# EAGLE design SchemaPCB1 (EAGLE 9.6.2)

## Sheet 1 of 5: ESP32
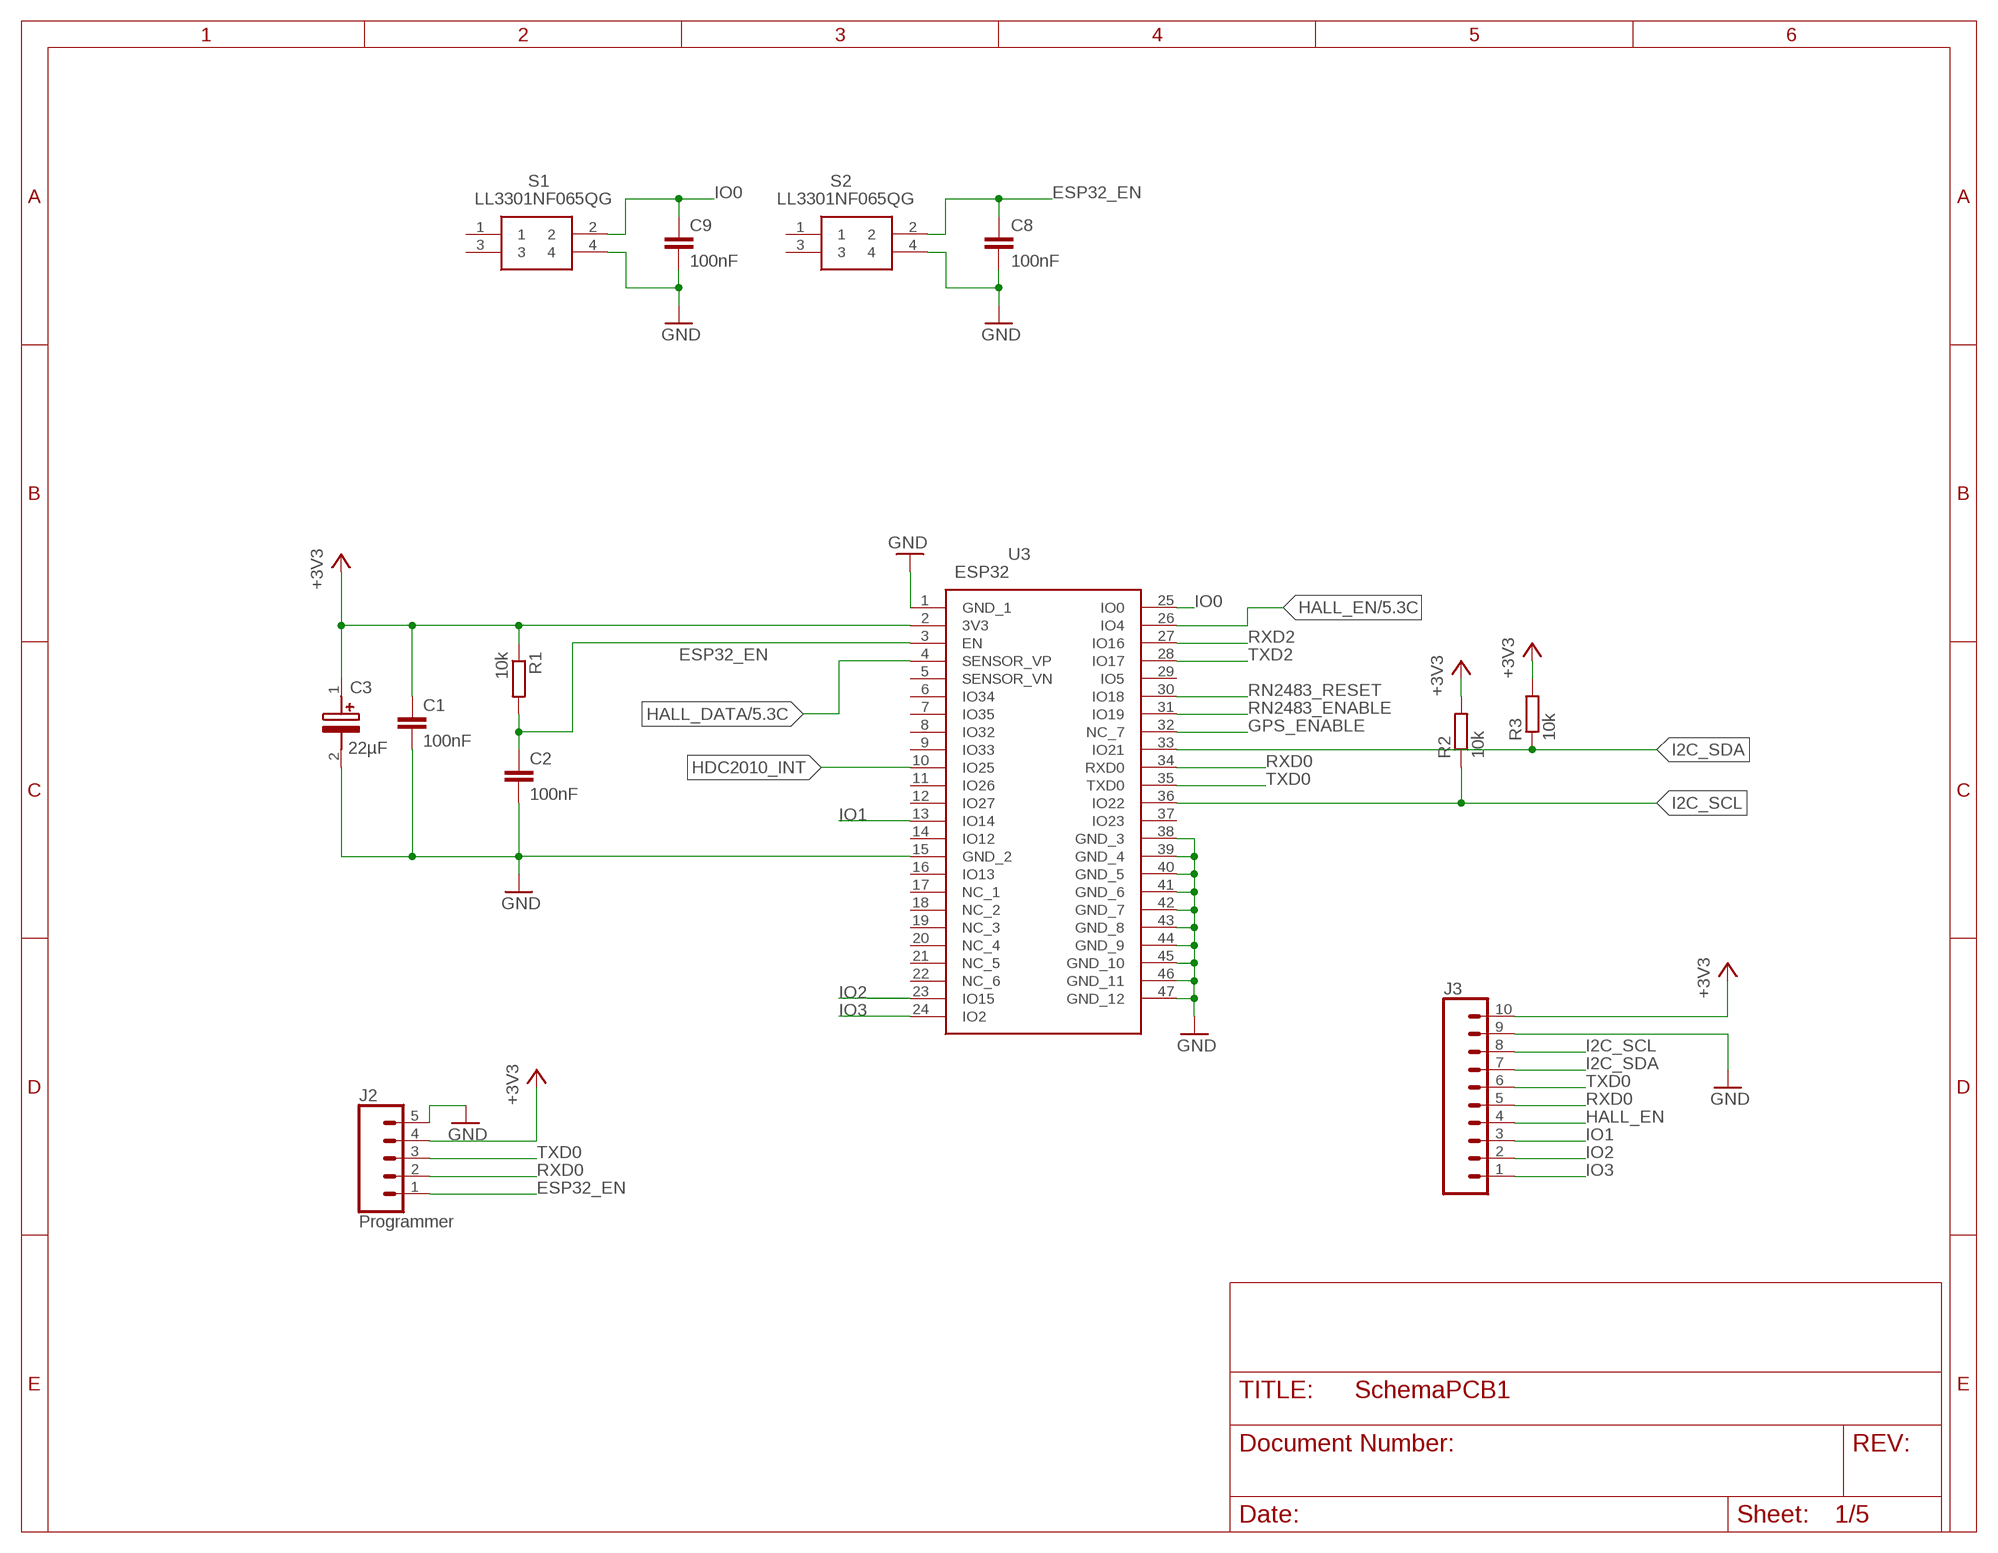
[diagram p0: schematic, sheet 1]

### Parts
C1  100nF  C-EU-0805C0805  [C0805]
C2  100nF  C-EU-0805C0805  [C0805]
C3  22µF  VE-220M1VTR-0605  [CAPAE660X550N]
C8  100nF  C-EU-0805C0805  [C0805]
C9  100nF  C-EU-0805C0805  [C0805]
J2  Programmer  CONN_05  [1X05]
J3  CONN_10"  [1X10]
R1  10k  R-EU_0805M0805  [M0805]
R2  10k  R-EU_R0805  [R0805]
R3  10k  R-EU_R0805  [R0805]
S1  LL3301NF065QG  [LL3301NF065QG]
S2  LL3301NF065QG  [LL3301NF065QG]
U3  ESP32  ESP32-WROOM-32E_M113EH3200PH3Q  [ESP32WROOM32EM113EH3200PH3Q0]

### Nets
+3V3: C1.1 C3.1(+) J2.4 J3.10 R1.1 R2.2 R3.2 U3.2(3V3) ; also sheet 2,3,4,5
ESP32_EN: C2.1 C8.2 J2.1 R1.2 S2.2 U3.3(EN)
GND: C1.2 C2.2 C3.2(-) C8.1 C9.2 J2.5 J3.9 S1.4 S2.4 U3.1(GND_1) U3.15(GND_2) U3.38(GND_3) U3.39(GND_4) U3.40(GND_5) U3.41(GND_6) U3.42(GND_7) U3.43(GND_8) U3.44(GND_9) U3.45(GND_10) U3.46(GND_11) U3.47(GND_12) ; also sheet 2,3,4,5
GPS_ENABLE: U3.32(NC_7) ; also sheet 3
HALL_DATA: U3.4(SENSOR_VP) ; also sheet 5
HALL_EN: J3.4 U3.26(IO4) ; also sheet 5
HDC2010_INT: U3.10(IO25) ; also sheet 5
I2C_SCL: J3.8 R2.1 U3.36(IO22) ; also sheet 3,5
I2C_SDA: J3.7 R3.1 U3.33(IO21) ; also sheet 3,5
IO0: C9.1 S1.2 U3.25(IO0)
IO1: J3.3 U3.13(IO14)
IO2: J3.2 U3.23(IO15)
IO3: J3.1 U3.24(IO2)
RN2483_ENABLE: U3.31(IO19) ; also sheet 2
RN2483_RESET: U3.30(IO18) ; also sheet 2
RXD0: J2.2 J3.5 U3.34(RXD0)
RXD2: U3.27(IO16) ; also sheet 2
TXD0: J2.3 J3.6 U3.35(TXD0)
TXD2: U3.28(IO17) ; also sheet 2
Unconnected: S1.1 S1.3 S2.1 S2.3 U3.5(SENSOR_VN) U3.6(IO34) U3.7(IO35) U3.8(IO32) U3.9(IO33) U3.11(IO26) U3.12(IO27) U3.14(IO12) U3.16(IO13) U3.17(NC_1) U3.18(NC_2) U3.19(NC_3) U3.20(NC_4) U3.21(NC_5) U3.22(NC_6) U3.29(IO5) U3.37(IO23)

## Sheet 2 of 5: LoRa
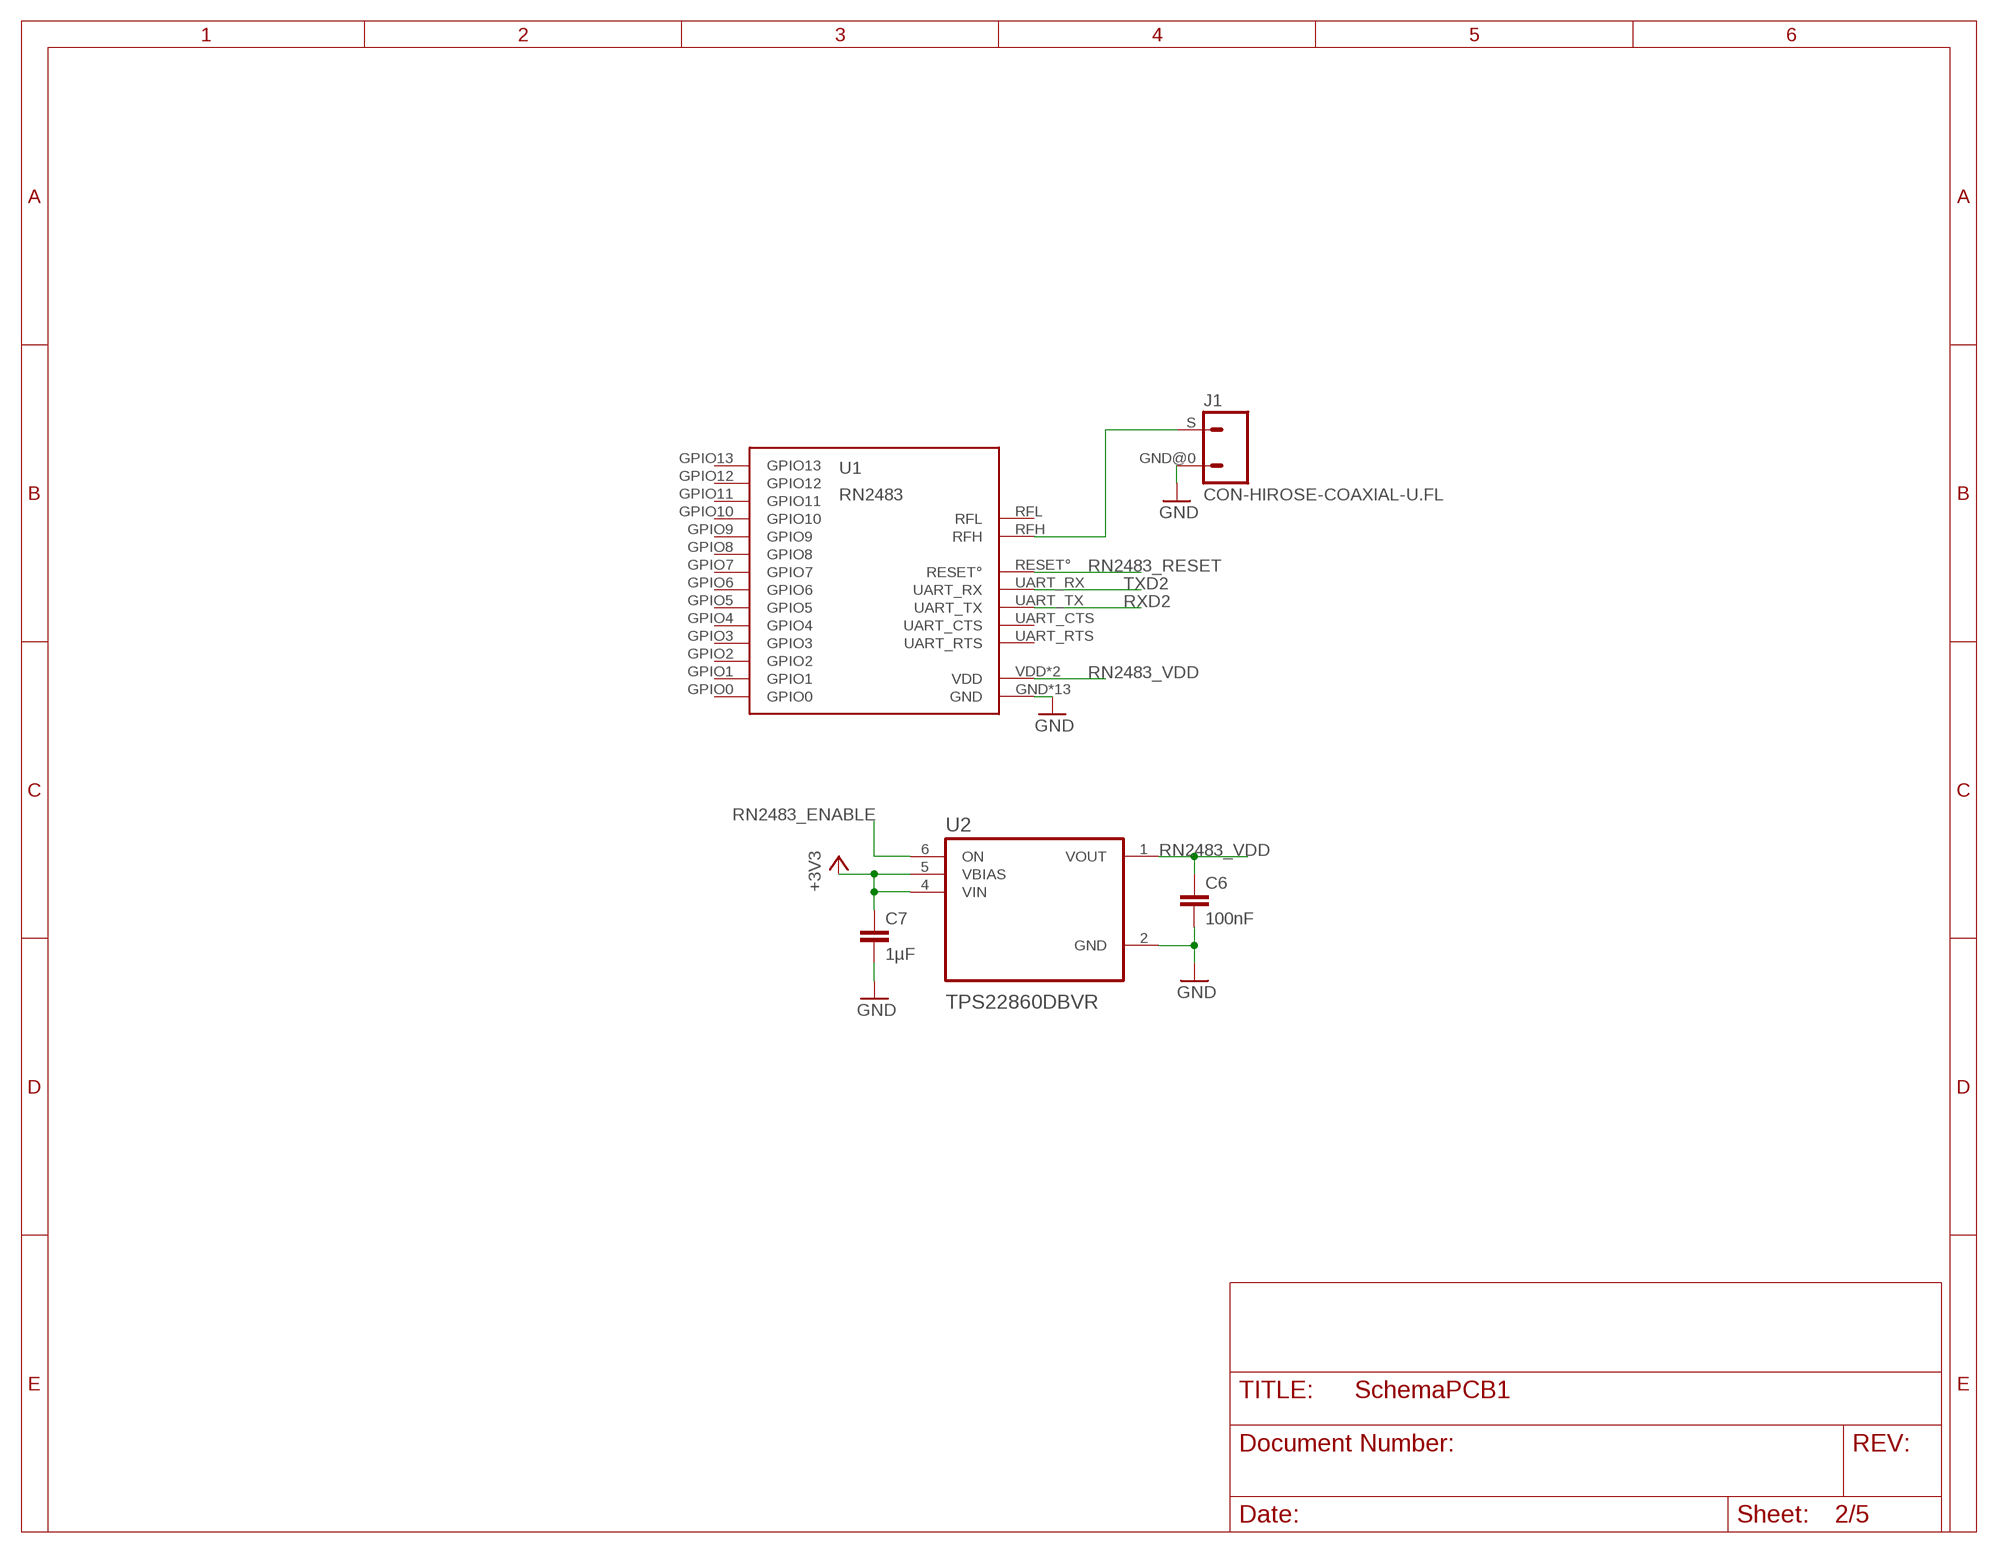
[diagram p1: schematic, sheet 2]

### Parts
C6  100nF  C-EU-0805C0805  [C0805]
C7  1µF  C-EU-0805C0805  [C0805]
J1  CON-HIROSE-COAXIAL-U.FL  [CON-U.FL]
U1  RN2483  [RN2483]
U2  TPS22860DBVR  [SOT95P280X145-6N]

### Nets
+3V3: C7.1 U2.4(VIN) U2.5(VBIAS) ; also sheet 1,3,4,5
GND: C6.2 C7.2 J1.GND@0 U1.GND U1.GND1(GND) U1.GND2(GND) U1.GND3(GND) U1.GND4(GND) U1.GND5(GND) U1.GND6(GND) U1.GND7(GND) U1.GND8(GND) U1.GND9(GND) U1.GND10(GND) U1.GND11(GND) U1.GND12(GND) U2.2(GND) ; also sheet 1,3,4,5
N$4: J1.S U1.RFH
RN2483_ENABLE: U2.6(ON) ; also sheet 1
RN2483_RESET: U1.RESET° ; also sheet 1
RN2483_VDD: C6.1 U1.VDD U1.VDD2(VDD) U2.1(VOUT)
RXD2: U1.UART_TX ; also sheet 1
TXD2: U1.UART_RX ; also sheet 1
Unconnected: U1.GPIO0 U1.GPIO1 U1.GPIO2 U1.GPIO3 U1.GPIO4 U1.GPIO5 U1.GPIO6 U1.GPIO7 U1.GPIO8 U1.GPIO9 U1.GPIO10 U1.GPIO11 U1.GPIO12 U1.GPIO13 U1.RFL U1.UART_CTS U1.UART_RTS

## Sheet 3 of 5: GPS
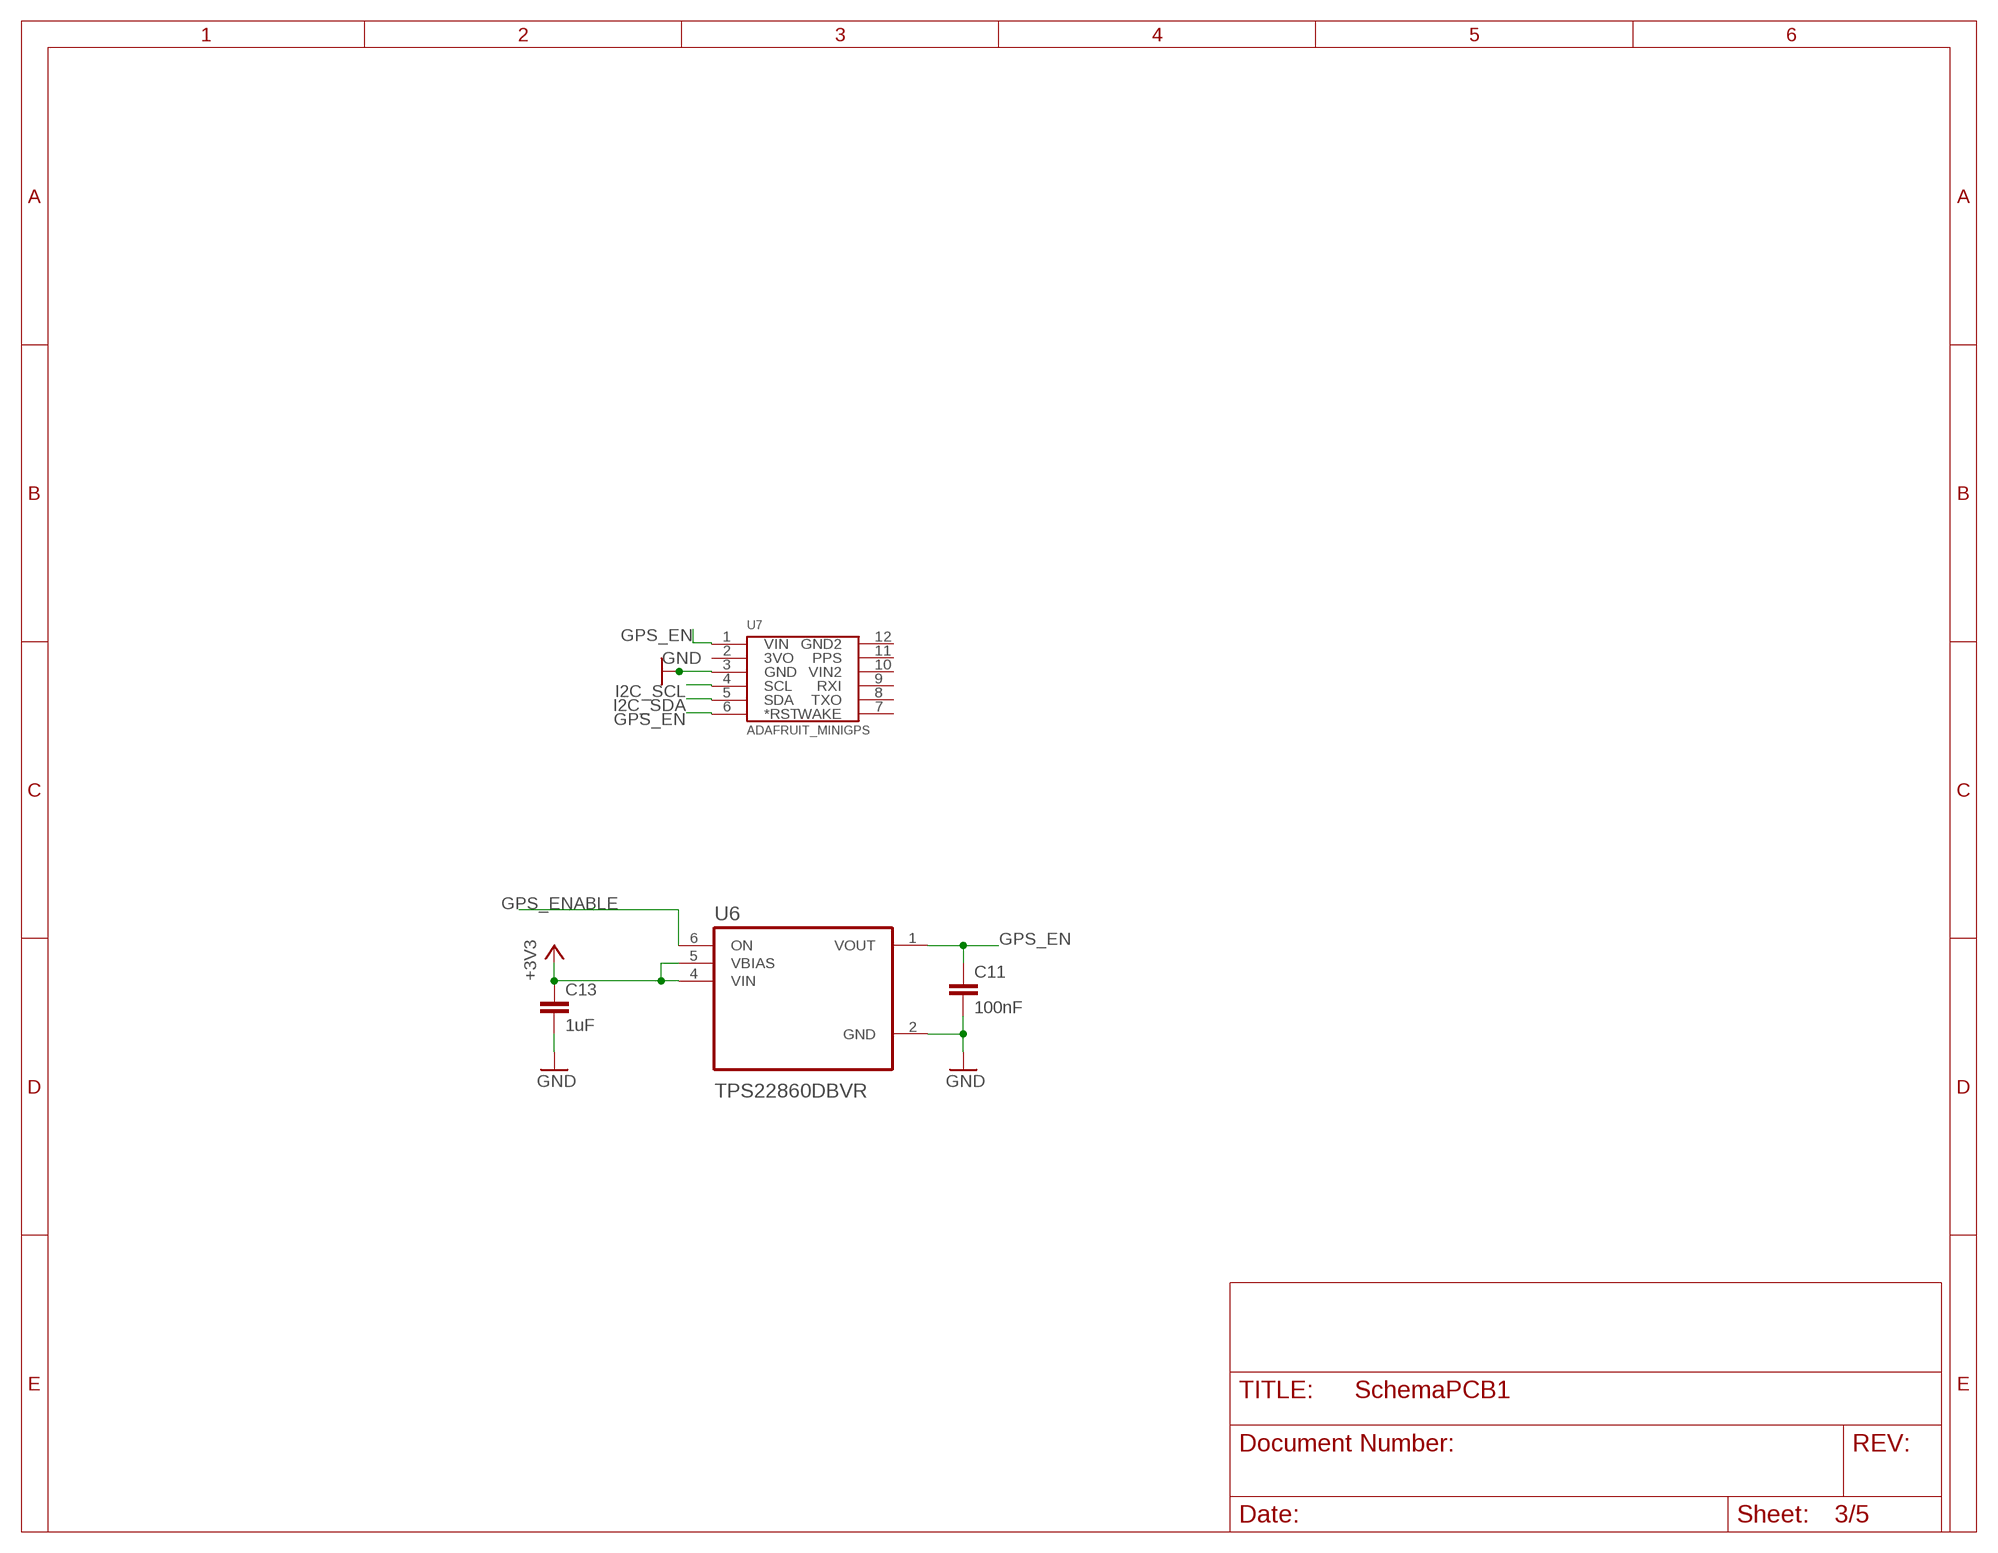
[diagram p2: schematic, sheet 3]

### Parts
C11  100nF  C-EUC0805  [C0805]
C13  1uF  C-EUC0805  [C0805]
U6  TPS22860DBVR  [SOT95P280X145-6N]
U7  ADAFRUIT_MINIGPS  [ADAFRUIT_MINIGPS]

### Nets
+3V3: C13.1 U6.4(VIN) U6.5(VBIAS) ; also sheet 1,2,4,5
GND: C11.2 C13.2 U6.2(GND) U7.3(GND) ; also sheet 1,2,4,5
GPS_EN: C11.1 U6.1(VOUT) U7.1(VIN) U7.6(*RST)
GPS_ENABLE: U6.6(ON) ; also sheet 1
I2C_SCL: U7.4(SCL) ; also sheet 1,5
I2C_SDA: U7.5(SDA) ; also sheet 1,5
Unconnected: U7.2(3VO) U7.7(WAKE) U7.8(TXO) U7.9(RXI) U7.10(VIN2) U7.11(PPS) U7.12(GND2)

## Sheet 4 of 5: Power
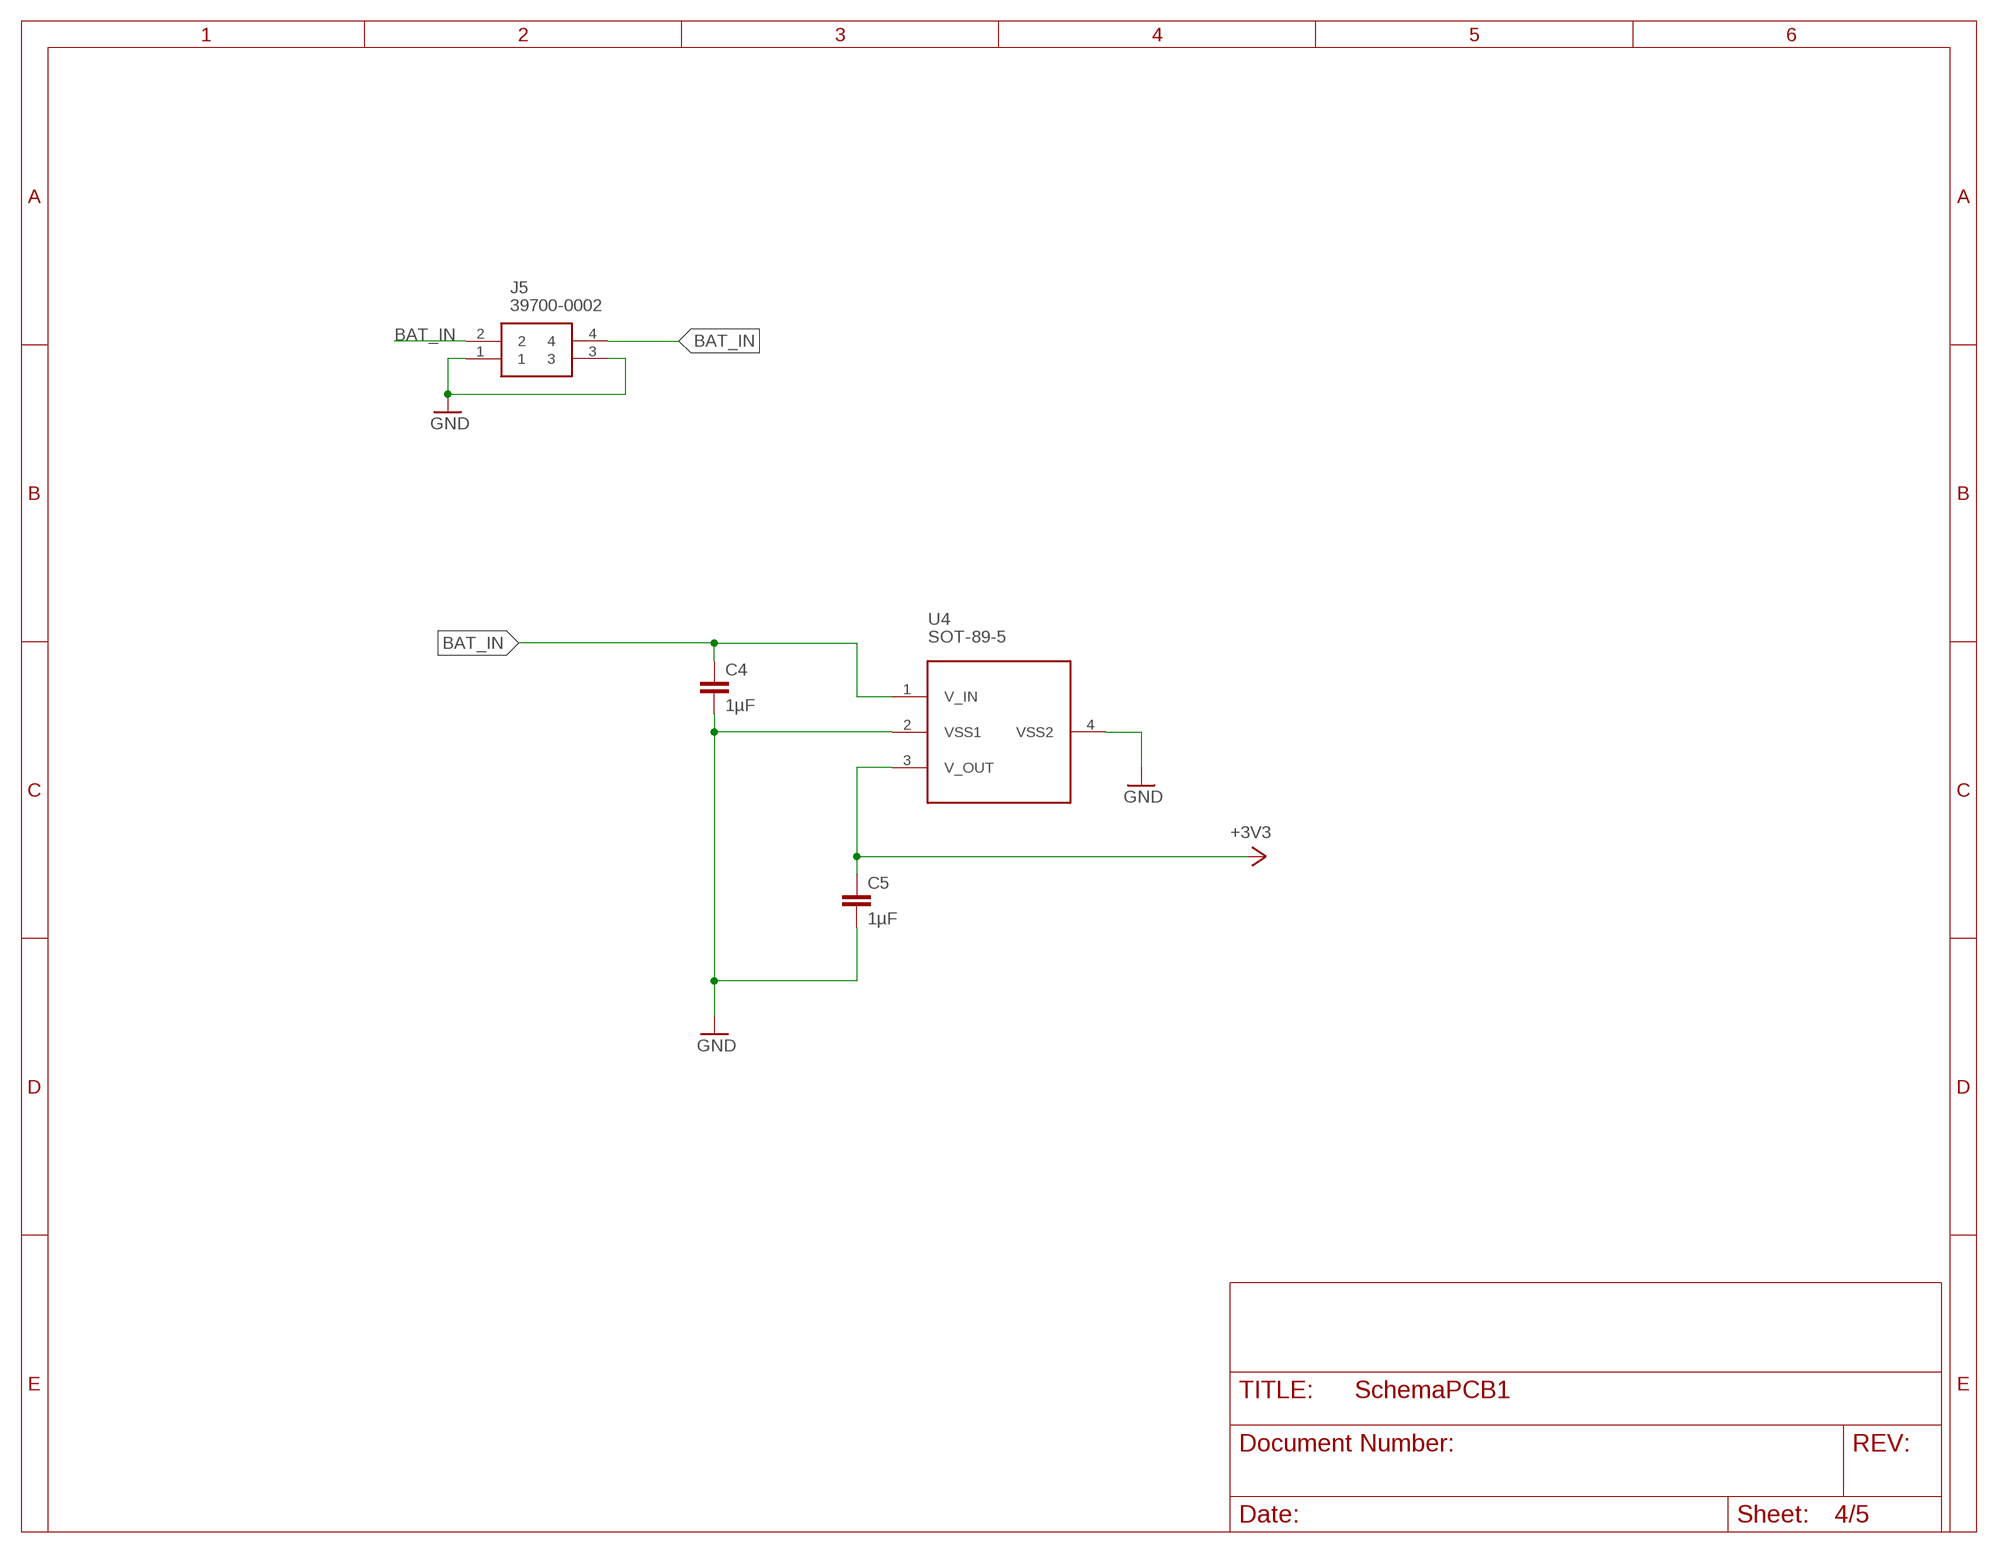
[diagram p3: schematic, sheet 4]

### Parts
C4  1µF  C-EU-0805C0805  [C0805]
C5  1µF  C-EU-0805C0805  [C0805]
J5  39700-0002  [397000002]
U4  SOT-89-5  [SOT-89]

### Nets
+3V3: C5.1 U4.3(V_OUT) ; also sheet 1,2,3,5
BAT_IN: C4.1 J5.2 J5.4 U4.1(V_IN)
GND: C4.2 C5.2 J5.1 J5.3 U4.2(VSS1) U4.4(VSS2) ; also sheet 1,2,3,5

## Sheet 5 of 5: Sensoren
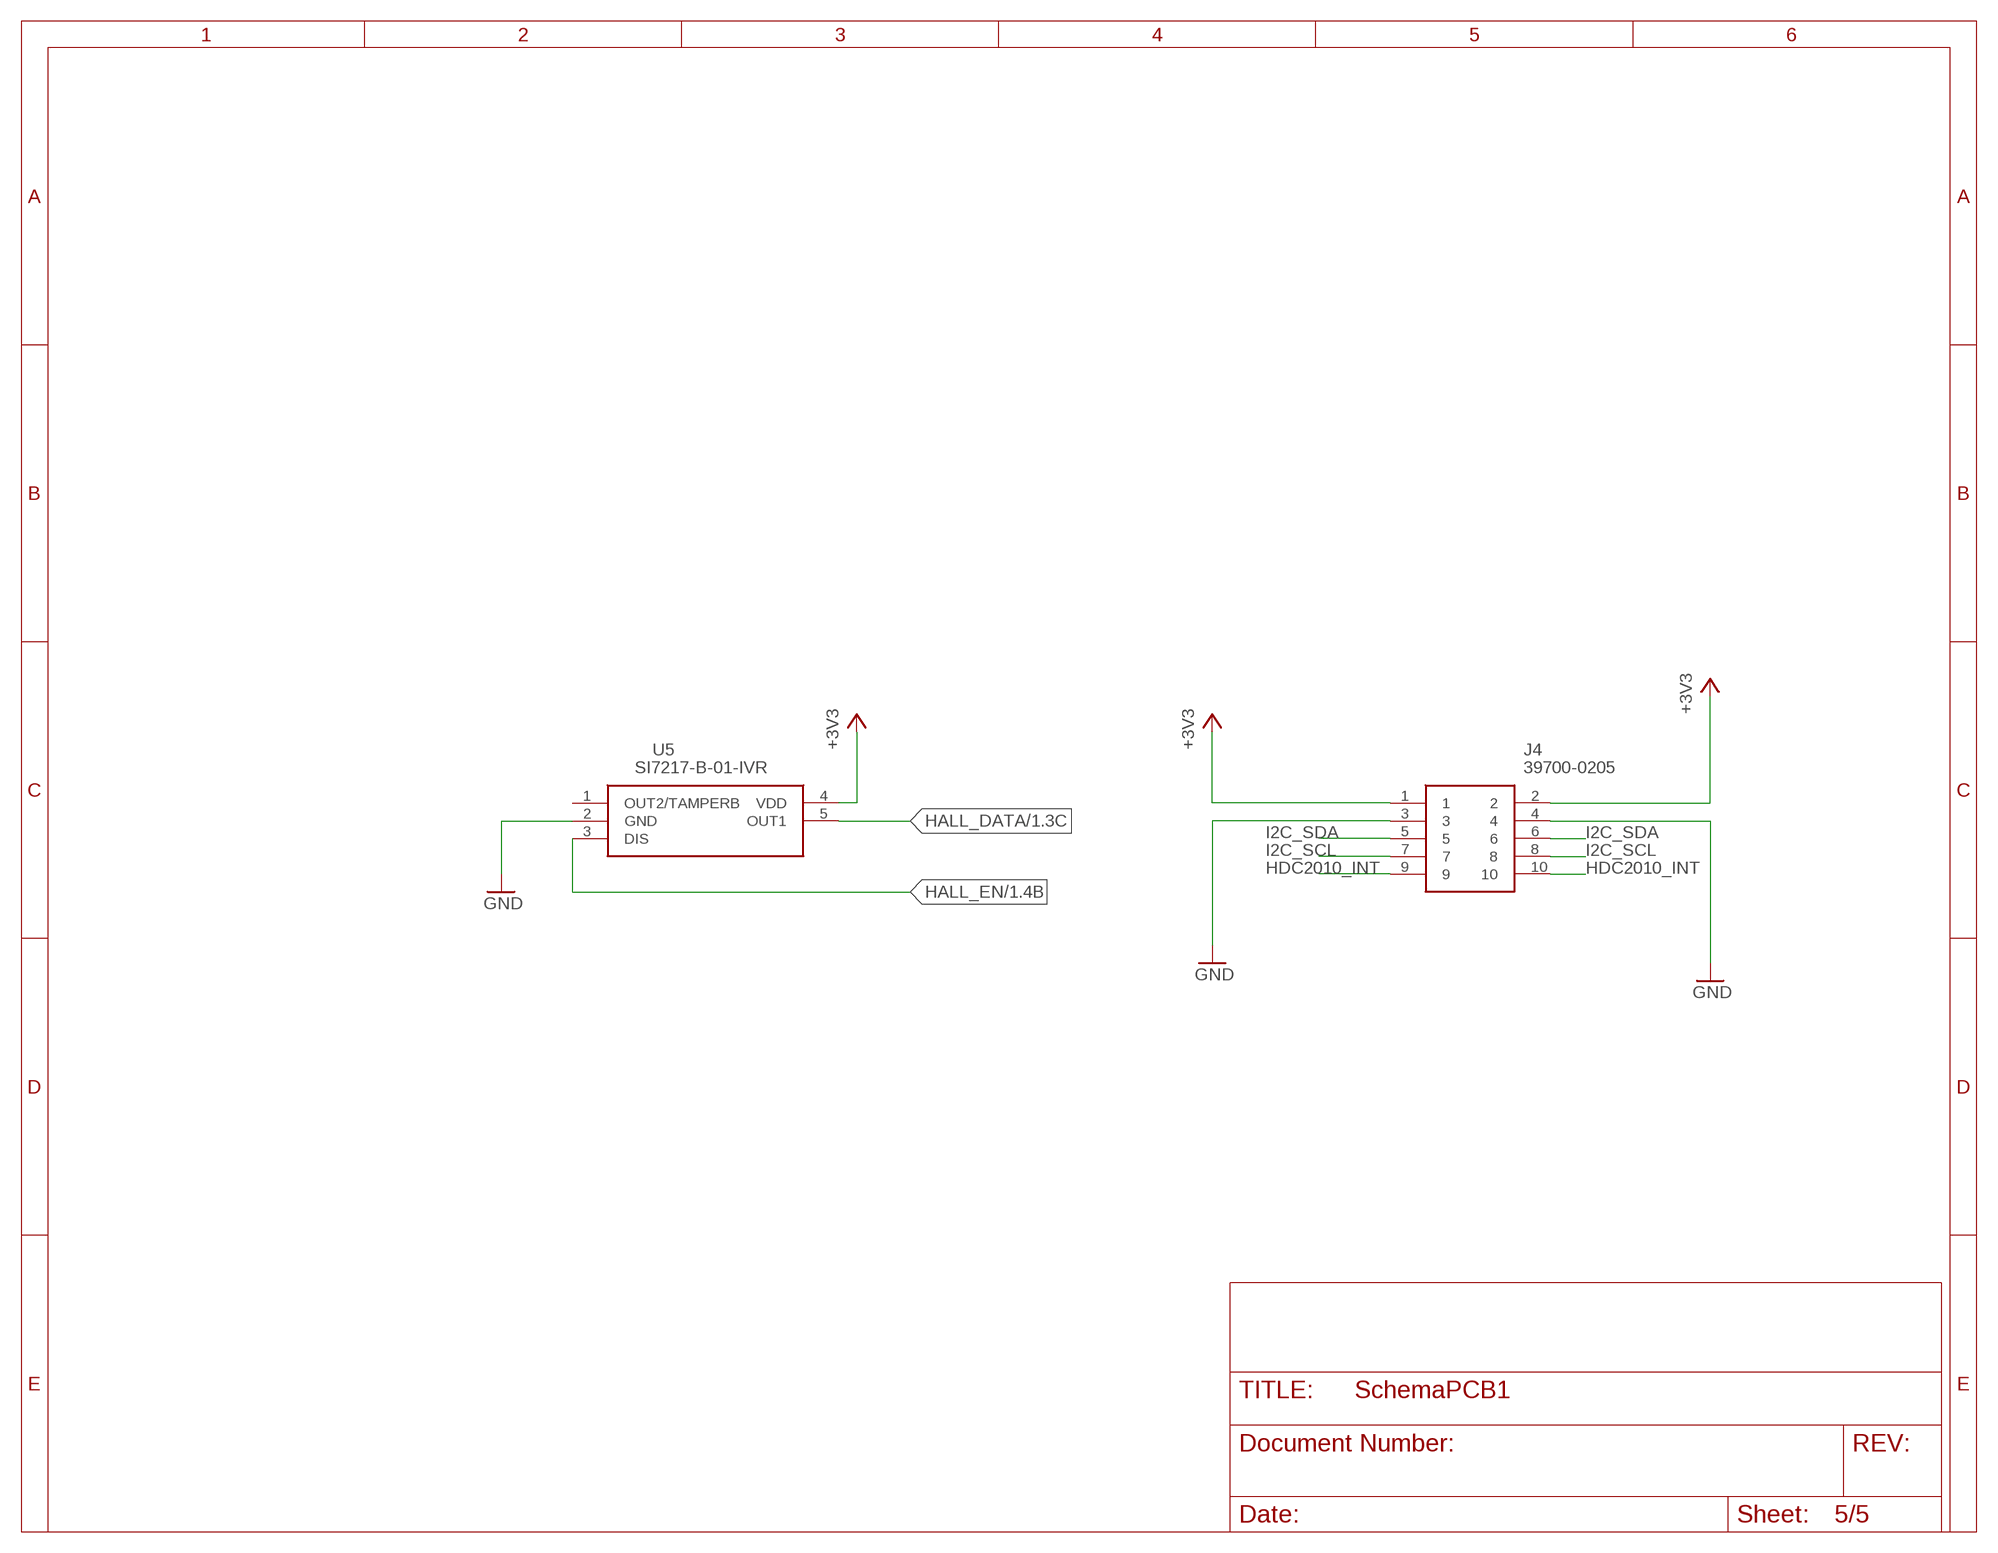
[diagram p4: schematic, sheet 5]

### Parts
J4  39700-0205  [397000205]
U5  SI7217-B-01-IVR  [SOT95P275X125-5N]

### Nets
+3V3: J4.1 J4.2 U5.4(VDD) ; also sheet 1,2,3,4
GND: J4.3 J4.4 U5.2(GND) ; also sheet 1,2,3,4
HALL_DATA: U5.5(OUT1) ; also sheet 1
HALL_EN: U5.3(DIS) ; also sheet 1
HDC2010_INT: J4.9 J4.10 ; also sheet 1
I2C_SCL: J4.7 J4.8 ; also sheet 1,3
I2C_SDA: J4.5 J4.6 ; also sheet 1,3
Unconnected: U5.1(OUT2/TAMPERB)

## Library data of the parts
C1 C2 C4-C9 = --CoolTeamLib:C-EU-0805: CAPACITOR, European symbol; SPICEPREFIX: C
C3 = --CoolTeamLib:VE-220M1VTR-0605: Aluminum Electrolytic Capacitors - SMD 35 Volts 22uF 20% 6.3x5.3 Source: Datasheet <http://www.lelon.com.tw/down.php?f=/file/7.pdf&n=VE.pdf>; DESCRIPTION: Aluminum Electrolytic Capacitors - SMD 35 Volts 22uF 20% 6.3x5.3; HEIGHT: 5.5mm; MANUFACTURER_NAME: Lelon; MANUFACTURER_PART_NUMBER: VE-220M1VTR-0605; MOUSER_PART_NUMBER: 140-VE220M1VTR0605; MOUSER_PRICE-STOCK: https://www.mouser.co.uk/ProductDetail/Lelon/VE-220M1VTR-0605?qs=GtPRU6UQL8zyOYeXsjuA%252Bg%3D%3D
C11 C13 = rcl:C-EU: CAPACITOR, European symbol; SPICEPREFIX: C
J1 = --CoolTeamLib:CON-HIROSE-COAXIAL: Hirose SMT 50 ohm impedance connector W.FL ............................. 1.4mm mated height, ultra small SMT connectors .................................. DC to 3GHz U.FL .............................. 1.9mm or 2.4mm mated height, ultra small SMT connectors ................... DC to 6GHz E.FL ............................... 3.2mm mated height, ultra small SMT connectors .................................. DC to 2GHz H.FL .............................. 3.0mm mated height, ultra small SMT connectors ................................... DC to 3GHz S.FL. ............................. 6.0mm mated height, SMT connectors ................................................... DC to 2.5GHz FL ................................. 10.5mm mated height, SMT connectors .................................................. DC to 1.5GHz Please send any comments to: messi@users.sourceforge.net
J2 = --CoolTeamLib:CONN_05: Multi connection point. Often used as Generic Header-pin footprint for 0.1 inch spaced/style header connections On any of the 0.1 inch spaced packages, you can populate with these: Break Away Headers - Straight <https://www.sparkfun.com/products/116> (PRT-00116) Break Away Male Headers - Right Angle <https://www.sparkfun.com/products/553> (PRT-00553) Female Headers <https://www.sparkfun.com/products/115> (PRT-00115) Break Away Headers - Machine Pin <https://www.sparkfun.com/products/117> (PRT-00117) Break Away Female Headers - Swiss Machine Pin <https://www.sparkfun.com/products/743> (PRT-00743) For SCREWTERMINALS and SPRING TERMINALS visit here: Screw Terimnals on SparkFun.com <https://www.sparkfun.com/search/results?term=Screw+Terminals> (5mm/3.5mm/2.54mm spacing) This device is also useful as a general connection point to wire up your design to another part of your project. Our various solder wires solder well into these plated through hole pads. Hook-Up Wire - Assortment (Stranded, 22 AWG) <https://www.sparkfun.com/products/11375> (PRT-11375) Hook-Up Wire - Assortment (Solid Core, 22 AWG) <https://www.sparkfun.com/products/11367> (PRT-11367) View the entire wire category on our website here <https://www.sparkfun.com/categories/141> Special notes: Molex polarized connector foot print use with SKU : PRT-08231 with associated crimp pins and housings. 1MM SMD Version SKU: PRT-10208
J3 = --CoolTeamLib:CONN_10: Multi connection point. Often used as Generic Header-pin footprint for 0.1 inch spaced/style header connections On any of the 0.1 inch spaced packages, you can populate with these: Break Away Headers - Straight <https://www.sparkfun.com/products/116> (PRT-00116) Break Away Male Headers - Right Angle <https://www.sparkfun.com/products/553> (PRT-00553) Female Headers <https://www.sparkfun.com/products/115> (PRT-00115) Break Away Headers - Machine Pin <https://www.sparkfun.com/products/117> (PRT-00117) Break Away Female Headers - Swiss Machine Pin <https://www.sparkfun.com/products/743> (PRT-00743) Arduino Stackable Header - 10 Pin <https://www.sparkfun.com/products/11376> (PRT-11376) For SCREWTERMINALS and SPRING TERMINALS visit here: Screw Terimnals on SparkFun.com <https://www.sparkfun.com/search/results?term=Screw+Terminals> (5mm/3.5mm/2.54mm spacing) This device is also useful as a general connection point to wire up your design to another part of your project. Our various solder wires solder well into these plated through hole pads. Hook-Up Wire - Assortment (Stranded, 22 AWG) <https://www.sparkfun.com/products/11375> (PRT-11375) Hook-Up Wire - Assortment (Solid Core, 22 AWG) <https://www.sparkfun.com/products/11367> (PRT-11367) View the entire wire category on our website here <https://www.sparkfun.com/categories/141> Special notes: Molex polarized connector foot print use with SKU : PRT-08231 with associated crimp pins and housings. 1MM SMD Version SKU: PRT-10208 NOTES ON THE VARIANTS LOCK and LOCK_LONGPADS... This footprint was designed to help hold the alignment of a through-hole component (i.e. 6-pin header) while soldering it into place. You may notice that each hole has been shifted either up or down by 0.005 of an inch from it's more standard position (which is a perfectly straight line). This slight alteration caused the pins (the squares in the middle) to touch the edges of the holes. Because they are alternating, it causes a "brace" to hold the component in place. 0.005 has proven to be the perfect amount of "off-center" position when using our standard breakaway headers. Although looks a little odd when you look at the bare footprint, once you have a header in there, the alteration is very hard to notice. Also,if you push a header all the way into place, it is covered up entirely on the bottom side.; PROD_ID: CONN-11563
J4 = --CoolTeamLib:39700-0205: Fixed Terminal Blocks SPRING TERMINAL BLOCK 5C-VERT GREEN Source: Datasheet <https://componentsearchengine.com//39700-0205.pdf>; DESCRIPTION: Fixed Terminal Blocks SPRING TERMINAL BLOCK 5C-VERT GREEN; HEIGHT: 14mm; MANUFACTURER_NAME: Molex; MANUFACTURER_PART_NUMBER: 39700-0205; MOUSER_PART_NUMBER: 538-39700-0205; MOUSER_PRICE-STOCK: https://www.mouser.co.uk/ProductDetail/Molex/39700-0205?qs=iVQMhOBiFE44PbCr6CEU0w%3D%3D
J5 = --CoolTeamLib:39700-0002: Fixed Terminal Blocks SPRING TERMINAL BLOCK 2C-GREEN Source: Datasheet <https://componentsearchengine.com/Datasheets/1/39700-0002.pdf>; DESCRIPTION: Fixed Terminal Blocks SPRING TERMINAL BLOCK 2C-GREEN; HEIGHT: 12.7mm; MANUFACTURER_NAME: Molex; MANUFACTURER_PART_NUMBER: 39700-0002; MOUSER_PART_NUMBER: 538-39700-0002; MOUSER_PRICE-STOCK: https://www.mouser.co.uk/ProductDetail/Molex/39700-0002?qs=EibfsPFbZaqB1%252BjDW0HuPQ%3D%3D
R1 = --CoolTeamLib:R-EU_0805: RESISTOR, European symbol
R2 R3 = rcl:R-EU_: RESISTOR, European symbol; SPICEPREFIX: R
S1 S2 = --CoolTeamLib:LL3301NF065QG: E-SWITCH - LL3301NF065QG - TACTILE SW, SPST, 0.05A, 12VDC, SOLDER Source: Datasheet <http://spec_sheets.e-switch.com/specs/P090002.pdf>; DESCRIPTION: E-SWITCH - LL3301NF065QG - TACTILE SW, SPST, 0.05A, 12VDC, SOLDER; HEIGHT: 4mm; MANUFACTURER_NAME: E-Switch; MANUFACTURER_PART_NUMBER: LL3301NF065QG; MOUSER_PART_NUMBER: 612-LL3301NF065QG; MOUSER_PRICE-STOCK: https://www.mouser.co.uk/ProductDetail/E-Switch/LL3301NF065QG/?qs=QtyuwXswaQiWhwgY68YTTw%3D%3D
U1 = --CoolTeamLib:RN2483: RN2483 Microchip Low-Power Lora Transceiver Module NOT TESTED There are testpads on the bottom of the device. The mask is supposed to cover that, but I have not tested it in practice yet. Info: http://www.microchip.com/wwwproducts/Devices.aspx?product=RN2483 Datasheet: http://ww1.microchip.com/downloads/en/DeviceDoc/50002346B.pdf Adapted from: https://github.com/Octanis1/Octanis1-Electronics/blob/ae493cac28c100e20856abe563dfe8824e9cc4bd/lib/Octanis1.lbr
U2 = --TPS22860DBVR:TPS22860DBVR: Check prices <https://pricing.snapeda.com/parts/TPS22860DBVR/Texas%20Instruments/view-part?ref=eda>; AVAILABILITY: Good; DESCRIPTION: 0.73-?, 5-V, ultra-low leakage load switch 6-SOT-23 -40 to 85; MF: Texas Instruments; MP: TPS22860DBVR; PACKAGE: SOT-23-6 Texas Instruments; PRICE: None; PURCHASE-URL: https://pricing.snapeda.com/search/part/TPS22860DBVR/?ref=eda
U3 = --CoolTeamLib:ESP32-WROOM-32E_M113EH3200PH3Q: WiFi Modules (802.11) SMD Module ESP32-D0WD-V3, 4 MB SPI flash, PCB antenna Source: Datasheet <https://www.mouser.com/datasheet/2/891/esp32-wroom-32e_esp32-wroom-32ue_datasheet_en-1855879.pdf>; DESCRIPTION: WiFi Modules (802.11) SMD Module ESP32-D0WD-V3, 4 MB SPI flash, PCB antenna; HEIGHT: 3.25mm; MANUFACTURER_NAME: Espressif Systems; MANUFACTURER_PART_NUMBER: ESP32-WROOM-32E(M113EH3200PH3Q0); MOUSER_PART_NUMBER: 356-ESP32WRM32E132PH; MOUSER_PRICE-STOCK: https://www.mouser.co.uk/ProductDetail/Espressif-Systems/ESP32-WROOM-32EM113EH3200PH3Q0/?qs=vHuUswq2%252Bsx8Xcp7bzmaHA%3D%3D
U4 = --CoolTeamLib:SOT-89-5
U5 = --CoolTeamLib:SI7217-B-01-IVR: Silicon Laboratories Si7217-B-01-IVR, Linear Hall Effect Sensor, 5-Pin SOT-23 Source: Datasheet <https://www.silabs.com/documents/public/data-sheets/si721x-data-sheet.pdf>; DESCRIPTION: Silicon Laboratories Si7217-B-01-IVR, Linear Hall Effect Sensor, 5-Pin SOT-23; HEIGHT: 1.25mm; MANUFACTURER_NAME: Silicon Labs; MANUFACTURER_PART_NUMBER: Si7217-B-01-IVR; MOUSER_PART_NUMBER: 634-SI7217-B-01-IVR; MOUSER_PRICE-STOCK: https://www.mouser.co.uk/ProductDetail/Silicon-Labs/SI7217-B-01-IVR?qs=gt1LBUVyoHkrxsCwZZ9dQw%3D%3D
U6 = --CoolTeamLib:TPS22860DBVR: Check prices <https://pricing.snapeda.com/parts/TPS22860DBVR/Texas%20Instruments/view-part?ref=eda>; AVAILABILITY: Good; DESCRIPTION: 0.73-?, 5-V, ultra-low leakage load switch 6-SOT-23 -40 to 85; MF: Texas Instruments; MP: TPS22860DBVR; PACKAGE: SOT-23-6 Texas Instruments; PRICE: None; PURCHASE-URL: https://pricing.snapeda.com/search/part/TPS22860DBVR/?ref=eda
U7 = gps:ADAFRUIT_MINIGPS

## Board
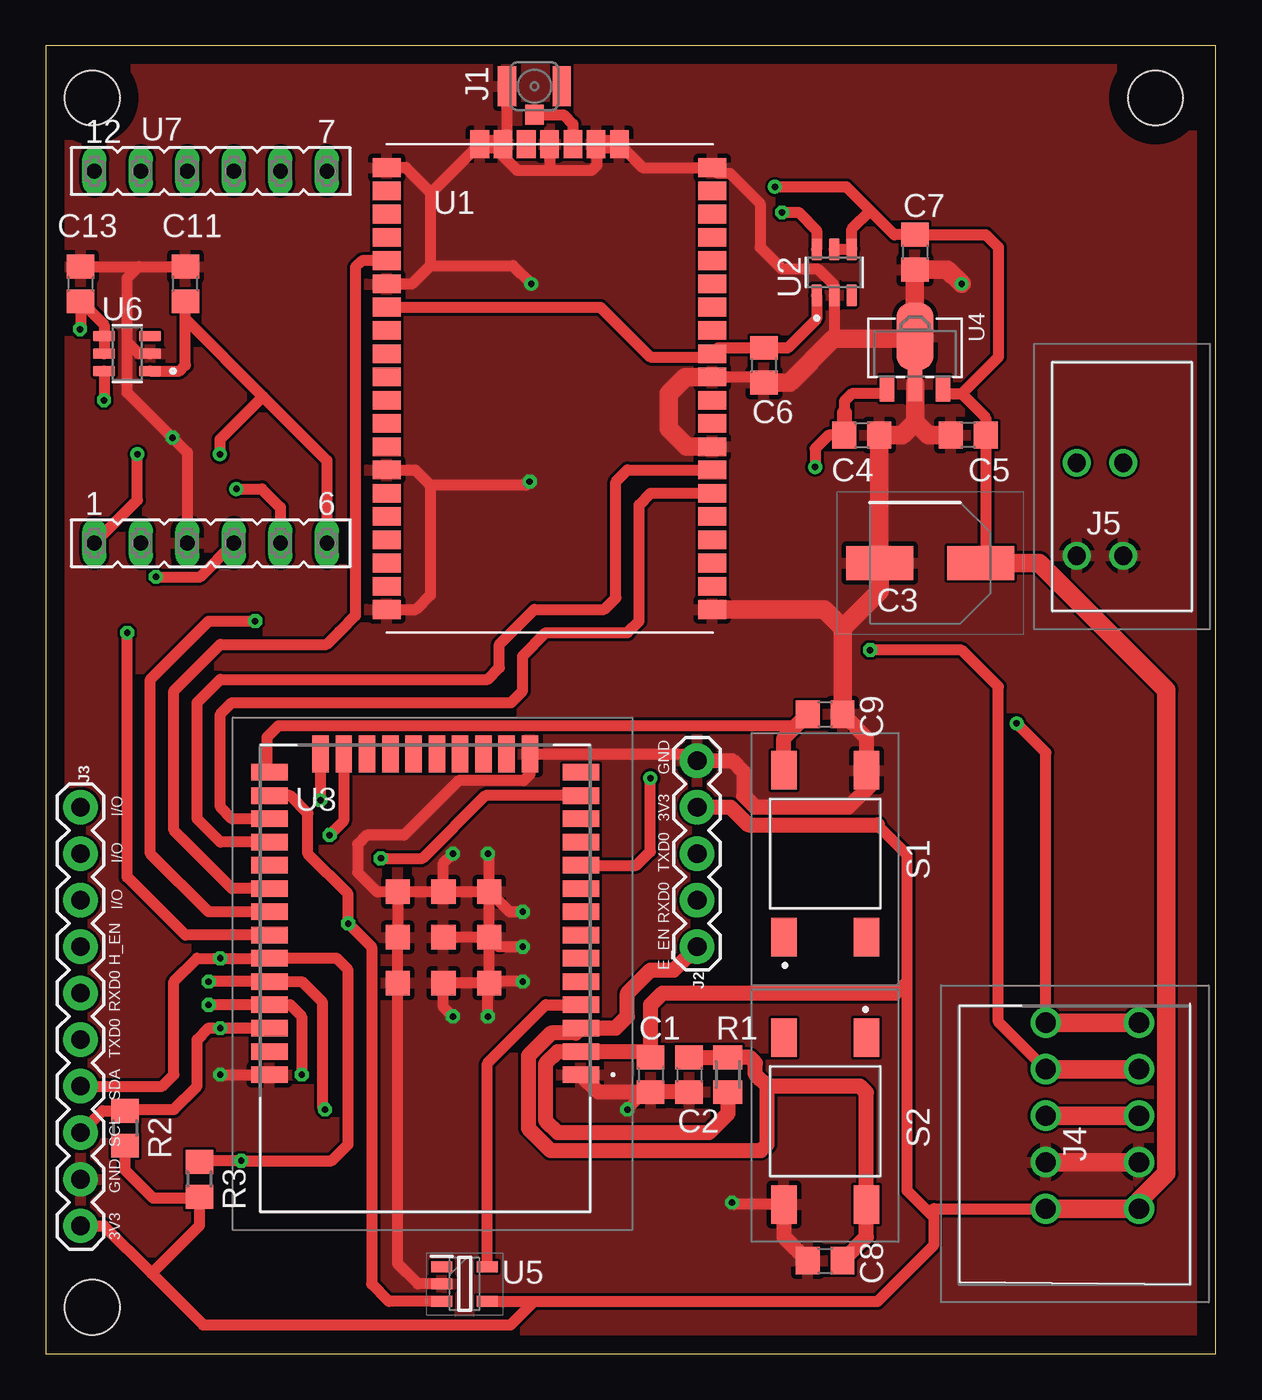
[diagram p5: board, top side]
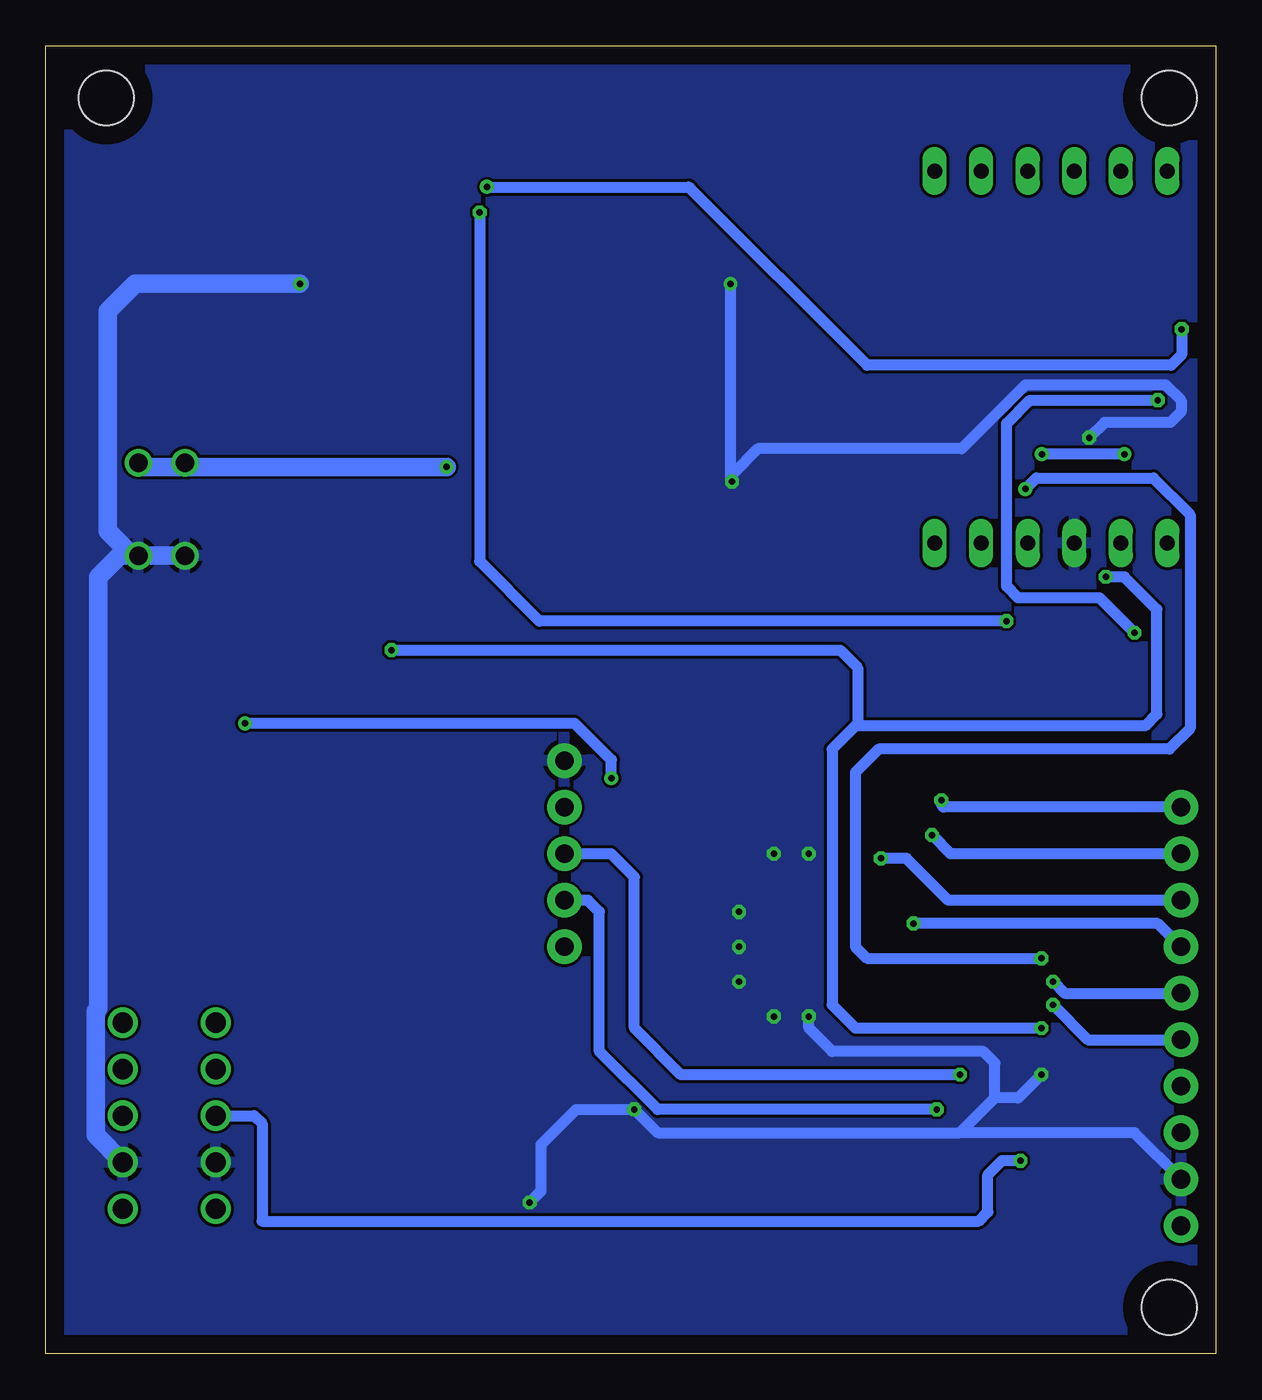
[diagram p6: board, bottom side, seen from below]

Size 63.88 x 71.42 mm. Coordinates in mm from the lower left corner, seen from the top.
Outline: 0,0 63.88,0 63.88,71.42 0,71.42 0,0
Copper layers (1*16): Top 0.035mm / dielectric 1.5mm / Bottom 0.035mm
Design rules "default": minimum track width 6mil, minimum drill 0.35mm, track to track 6mil, track to pad 6mil, pad to pad 6mil, via to via 6mil, smd to smd 6mil, copper to edge 40mil, drill to drill 6mil, minimum pad ring 10mil, minimum via ring 8mil, stop-mask expansion 4mil, vias tented up to drill 0mil, thermal gap 10mil
Holes 3 mm at 2.54,2.54 60.58,68.58 2.54,68.58

### Footprints (pad centres in the part's own frame; a part is rotated, then mirrored left to right if it is on the bottom)
C0805 = smd 1.3 x 1.5: 1 -0.95,0; 2 0.95,0
CAPAE660X550N = smd 3.65 x 1.85: 1 -2.75,0; 2 2.75,0
CON-U.FL = smd 1 x 2.2: GND@0 -1.5,0; GND@1 1.5,0 | smd 1 x 1.1: S 0,-1.55
1X05 = drill 1.016 pad 1.88: 1 0,0; 2 2.54,0; 3 5.08,0; 4 7.62,0; 5 10.16,0
1X10 = drill 1.016 pad 1.88: 1 0,0; 2 2.54,0; 3 5.08,0; 4 7.62,0; 5 10.16,0; 6 12.7,0; 7 15.24,0; 8 17.78,0; 9 20.32,0; 10 22.86,0
397000205 = drill 1.1 pad 1.65: 1 0,0; 2 0,5.08; 3 2.54,0; 4 2.54,5.08; 5 5.08,0; 6 5.08,5.08; 7 7.62,0; 8 7.62,5.08; 9 10.16,0; 10 10.16,5.08
397000002 = drill 1 pad 1.5: 1 0,0; 2 0,5.08; 3 2.54,0; 4 2.54,5.08
M0805 = smd 1.3 x 1.6: 1 -0.95,0; 2 0.95,0
R0805 = smd 1.3 x 1.5: 1 -0.95,0; 2 0.95,0
LL3301NF065QG = smd 2.1 x 1.4: 1 -4.55,2.25; 2 4.55,2.25; 3 -4.55,-2.25; 4 4.55,-2.25
RN2483 = smd 1.524 x 1.016: GND 17.78,1.27; GND1 17.78,10.16; GND2 17.78,13.97; GND3 17.78,25.4; GND9 0,25.4; GND10 0,19.05; GND11 0,8.89; GND12 0,1.27; GPIO0 0,16.51; GPIO1 0,15.24; GPIO2 0,13.97; GPIO3 0,12.7; GPIO4 0,11.43; GPIO5 0,10.16; GPIO6 0,6.35; GPIO7 0,5.08; GPIO8 0,3.81; GPIO9 0,2.54; GPIO10 17.78,17.78; GPIO11 17.78,16.51; GPIO12 17.78,12.7; GPIO13 17.78,11.43; P$1 0,21.59; P$2 0,22.86; P$3 0,24.13; P$4 17.78,24.13; P$5 17.78,22.86; P$6 17.78,21.59; P$7 17.78,20.32; P$8 17.78,19.05; P$9 17.78,6.35; P$10 17.78,5.08; P$11 0,7.62; RESET° 0,20.32; UART_CTS 17.78,3.81; UART_RTS 17.78,2.54; UART_RX 17.78,8.89; UART_TX 17.78,7.62; VDD 17.78,15.24; VDD2 0,17.78 | smd 1.016 x 1.524: GND4 12.7,26.67; GND5 11.43,26.67; GND6 8.89,26.67; GND7 6.35,26.67; GND8 5.08,26.67; RFH 10.16,26.67; RFL 7.62,26.67
SOT95P280X145-6N = smd 1.21 x 0.58: 1 -1.255,0.95; 2 -1.255,0; 3 -1.255,-0.95; 4 1.255,-0.95; 5 1.255,0; 6 1.255,0.95
ESP32WROOM32EM113EH3200PH3Q0 = smd 2 x 0.9: 1 0,0; 2 0,-1.27; 3 0,-2.54; 4 0,-3.81; 5 0,-5.08; 6 0,-6.35; 7 0,-7.62; 8 0,-8.89; 9 0,-10.16; 10 0,-11.43; 11 0,-12.7; 12 0,-13.97; 13 0,-15.24; 14 0,-16.51; 25 17,-16.51; 26 17,-15.24; 27 17,-13.97; 28 17,-12.7; 29 17,-11.43; 30 17,-10.16; 31 17,-8.89; 32 17,-7.62; 33 17,-6.35; 34 17,-5.08; 35 17,-3.81; 36 17,-2.54; 37 17,-1.27; 38 17,0 | smd 0.9 x 2: 15 2.785,-17.51; 16 4.055,-17.51; 17 5.325,-17.51; 18 6.595,-17.51; 19 7.865,-17.51; 20 9.135,-17.51; 21 10.405,-17.51; 22 11.675,-17.51; 23 12.945,-17.51; 24 14.215,-17.51 | smd 1.33 x 1.33: 39 5,-5; 40 5,-7.5; 41 5,-10; 42 7.5,-10; 43 7.5,-7.5; 44 7.5,-5; 45 10,-5; 46 10,-7.5; 47 10,-10
SOT-89 = smd 0.8 x 1.4: 1 -1.524,-1.905; 3 1.524,-1.905 | smd 0.8 x 1.9: 2 0,-1.651 | smd 2.032 x 3.65: 4 0,0.94
SOT95P275X125-5N = smd 1.15 x 0.6: 1 -1.25,0.95; 2 -1.25,0; 3 -1.25,-0.95; 4 1.25,-0.95; 5 1.25,0.95
ADAFRUIT_MINIGPS = drill 0.813 long: 1 -6.25,-10.26; 2 -3.71,-10.26; 3 -1.17,-10.26; 4 1.37,-10.26; 5 3.91,-10.26; 6 6.45,-10.26; 7 6.45,10.06; 8 3.91,10.06; 9 1.37,10.06; 10 -1.17,10.06; 11 -3.71,10.06; 12 -6.25,10.06

### Placement (x,y rotation side)
C1  33.02,15.24 270 top
C2  35.12,15.24 270 top
C3  48.28,43.18 180 top
C4  44.55,50.16 0 top
C5  50.35,50.16 180 top
C6  39.2,53.97 270 top
C7  47.45,60.16 270 top
C8  42.55,5.08 0 top
C9  42.55,34.92 0 top
C11  7.62,58.42 90 top
C13  1.91,58.42 90 top
J1  26.67,69.22 0 top
J2  35.56,22.22 90 top
J3  1.91,29.85 270 top
J4  59.67,7.92 90 top
J5  56.28,43.58 0 top
R1  37.23,15.24 90 top
R2  4.32,12.32 270 top
R3  8.38,9.53 270 top
S1  42.55,27.31 90 top
S2  42.55,12.7 270 top
U1  18.61,39.37 0 top
U2  43.03,59.05 90 top
U3  29.21,15.24 180 top
U4  47.45,54.61 0 top
U5  22.86,3.81 0 top
U6  4.45,54.61 180 top
U7  8.9,54.52 0 top

### Tracks (layer width: path | path; a pad name or v marks a point on that pad's centre or on a via)
+3V3  (via drill 0.35)
  Top 0.152: 8.32,8.51 R3.2
  Top 0.61: U2.5 U2.4 44,60.33 44,61.42 45,62.42 | U6.5 U6.4 3.19,56.19 C13.1 1.91,55.98 v1.87,55.94 | U5.4 26.67,2.86 | 26.67,2.86 45.41,2.86 48.5,5.95 48.5,7.43 | 5.78,4.38 8.59,1.57 25.38,1.57 26.67,2.86 | 5.78,4.38 3.17,6.99 J3.10 | J4.2 48.5,7.92 48.5,7.43 | 45.39,28.88 47,27.27 47,20.33 | 46.35,19.68 47,20.33 | 48.5,7.43 47,8.92 47,20.33 | R2.2 4.32,10.03 5.84,8.51 8.32,8.51 | R3.2 8.38,6.99 5.78,4.38 | U4.3 49.25,52.42 50,52.42 | 50,52.42 51.3,51.12 C5.1 51.3,43.45 C3.1 | 50,52.42 52,54.42 52,60.42 51.32,61.11 C7.1 46.32,61.11 45,62.42 | 45,62.42 43.7,63.72 v39.8,63.72 v39.8,63.73
  Top 0.813: R1.1 37.23,13.1 36.2,12.07 27.94,12.07 27.3,12.7 27.3,15.88 27.94,16.51 U3.2 32.7,16.51 C1.1 33.02,19.05 33.66,19.68 46.35,19.68 | J2.4 37.37,29.85 38.34,28.88 45.39,28.88
  Top 1.016: J4.2 J4.1 59.67,8.36 61.17,9.85 61.17,36.26 54.24,43.18 C3.1
  Bottom 0.61: 28.74,63.68 19.04,53.97 2.45,53.97 1.87,54.55 v1.87,55.94 | 28.74,63.68 28.79,63.73 | 28.74,63.68 39.76,63.68 v39.8,63.72
BAT_IN  (via drill 0.35)
  Top 0.61: U4.1 45.65,52.42 44,52.42 43.59,52.02 43.59,51.37 | C4.1 42.74,50.16 42,49.42 v42,48.42
  Top 0.813: 43.59,51.37 C4.1
  Bottom 1.016: 56.05,48.42 J5.2 | J5.4 58.59,48.42 56.05,48.42 | v42,48.42 56.05,48.42
ESP32_EN
  Top 0.813: C2.1 R1.2 38.42,16.19 38.73,15.88 38.73,15.24 39.37,14.61 | C8.2 44.8,6.38 S2.2 44.8,14.26 44.45,14.61 39.37,14.61 | J2.1 34.29,20.96 33.02,20.96 31.75,19.68 31.75,18.42 31.11,17.78 U3.3 28.95,17.52 27.58,17.52 26.34,16.28 26.34,12.3 27.54,11.1 39.04,11.1 39.37,11.43 39.37,14.61
GND  (via drill 0.35)
  Top 0.61: C13.2 5.08,59.37 | 5.08,59.37 C11.2 | U6.2 5.08,54.61 4.45,55.24 | 4.45,55.24 4.45,58.73 5.08,59.37 | 4.45,55.24 4.45,52.48 6.9,50.02 v6.92,50.02 7.73,49.21 U7.3 | U3.47 U3.46 U3.45 19.21,4.92 20.32,3.81 U5.2 | U3.47 U3.42 | U3.42 U3.41 | U3.40 U3.41 | U3.39 24.21,20.32 | 24.21,20.32 U3.40 | U3.39 U3.44 21.71,18.93 v22.23,18.42 | U3.40 U3.43 | J2.5 35.2,32.75 U3.15 26.43,31.63 26.09,31.29 22.53,31.29 19.56,28.32 17.53,28.32 17.02,27.81 17.02,26.29 18.07,25.24 U3.47 | U1.GND4 32.58,64.77 U1.GND3 36.7,64.47 37.34,64.47 39,62.81 39,60.42 40.18,59.25 42.14,59.25 43.03,58.35 U2.2 43.03,55.46 43,55.42 | v31.75,13.33 32.7,14.29 C1.2 | S2.4 37.57,8.15 v37.47,8.25 | v9.53,15.24 U3.38 | v24.13,18.42 24.13,20.16 U3.39 | v26.04,20.32 24.21,20.32 | v26.04,22.22 24.73,22.22 U3.40 | v26.04,24.13 25.32,24.13 U3.41 | U3.41 24.21,27.22 v24.13,27.31 | U3.42 21.71,26.79 v22.23,27.31 | 47.33,55.42 U4.4 U4.2 | C6.2 38.88,53.34 U1.GND2 | J1.GND@0 25.17,66.25 U1.GND7 24.96,65.39 25.73,64.62 27.7,64.62 | 21,63.42 21,59.42 | 21,63.42 19.66,64.77 U1.GND9 | U1.GND8 21.07,63.42 21,63.42 | U1.GND12 20.21,40.64 21,41.42 21,47.42 | U1.GND11 20.16,48.26 21,47.42 | v26.41,47.62 26.21,47.42 21,47.42 | U1.GND10 20,58.42 21,59.42 | C9.2 | 21,59.42 25.5,59.42 v26.5,58.42 | U1.GND6 27.5,64.83 27.7,64.62 | 27.7,64.62 29.8,64.62 30.1,64.92 30.1,65.98 U1.GND5
  Top 0.813: U3.1 30.16,14.29 C1.2 C2.2 | S2.4 40.3,6.38 C8.1 | C9.2 44.8,33.62 S1.4 45.09,31.57 45.09,31.11 43.81,29.85 38.73,29.85 38.1,30.48 38.1,31.75 37.47,32.39 J2.5
  Top 1.016: 43.5,39.62 45.53,41.66 C3.2 45.49,43.22 C4.2 46.74,50.16 47.45,50.88 | v50,58.42 49.22,59.2 C7.2 U4.4 47.33,55.42 43,55.42 40.6,53.02 C6.2 | C5.2 48.16,50.16 47.45,50.88 | U1.GND 42.48,40.64 43.5,39.62 | C9.2 43.5,39.62 | U1.GND8 U1.GND7 | U1.GND2 34.91,53.34 34,52.42 34,50.52 34.99,49.53 U1.GND1 | U1.GND5 U1.GND4 | J4.4 J4.3 | U4.2 47.45,50.88
  Bottom 0.61: 13.97,12.07 30.48,12.07 v31.75,13.33 34.92,13.33 36.83,11.43 36.83,8.89 v37.47,8.25 | 13.97,12.07 12.06,13.97 | 12.06,13.97 12.06,15.88 12.7,16.51 20.95,16.51 22.23,17.78 v22.23,18.42 | J3.9 4.45,12.07 13.97,12.07 | v9.53,15.24 10.79,13.97 12.06,13.97 | v6.92,50.02 6.08,50.86 2.48,50.86 1.91,51.44 1.91,52.07 2.74,52.91 10.4,52.91 13.88,49.42 25,49.42 26.41,48.01 v26.41,47.62 26.5,47.71 v26.5,58.42
  Bottom 1.016: J4.3 61.16,11.94 61.16,18.69 61,18.85 61,42.42 59.85,43.58 J5.3 | v50,58.42 59,58.42 60.5,56.92 60.5,44.92 59.15,43.58 J5.3 | J5.1 J5.3
  pour Top: 0,71.12 63.9,71.12 63.9,0 0,0
  pour Bottom: 0,71.12 63.9,71.12 63.9,0 0,0
GPS_EN  (via drill 0.35)
  Top 0.61: U6.1 7.3,53.66 7.62,53.97 7.62,56.52 | 7.62,56.52 C11.1 | U7.6 15.35,48.78 11.86,52.28 | 7.62,56.52 11.86,52.28 | v5,49.12 5,46.61 U7.1 | 11.86,52.28 9.5,49.92 v9.5,49.12
  Bottom 0.61: v5,49.12 v9.5,49.12
GPS_ENABLE  (via drill 0.35)
  Top 0.61: U3.32 7.62,22.86 4.45,26.04 v4.45,39.37 | U6.6 3.19,52.08 v3.17,52.07
  Bottom 0.61: v4.45,39.37 5.75,40.67 6.35,41.27 10.79,41.27 11.43,41.91 11.43,50.8 10.16,52.07 v3.17,52.07
HALL_DATA
  Top 0.61: U5.5 24.11,15.86 27.3,19.05 U3.4
HALL_EN  (via drill 0.35)
  Top 0.61: U5.3 18.73,2.86 17.78,3.81 17.78,22.22 v16.51,23.5 16.51,25.1 14.3,27.31 14.3,29.51 13.34,30.48 U3.26
  Bottom 0.61: J3.4 3.17,23.5 v16.51,23.5
HDC2010_INT  (via drill 0.35)
  Top 0.61: J4.10 54.59,32.83 v53,34.42 | U3.10 32.24,26.67 33,27.43 v33,31.43
  Top 1.016: J4.10 J4.9
  Bottom 0.61: v33,31.43 33,32.42 35,34.42 v53,34.42
I2C_SCL  (via drill 0.35)
  Top 0.61: U3.36 v9.53,17.78 8.89,17.78 8.26,17.14 8.26,14.61 6.99,13.33 4.38,13.33 R2.1 3.11,13.27 J3.8 | J4.8 52,18.13 52,36.42 50,38.42 v45,38.42 | U7.4 8.43,42.42 v6.01,42.42
  Top 1.016: J4.8 J4.7
  Bottom 0.61: v9.53,17.78 19.68,17.78 20.95,19.05 20.95,33.02 19.68,34.29 19.56,34.29 | 19.56,34.29 3.86,34.29 3.23,34.92 3.23,40.65 5,42.42 v6.01,42.42 | v45,38.42 20.52,38.42 19.56,37.47 19.56,34.29
I2C_SDA  (via drill 0.35)
  Top 0.152: 8.45,10.54 R3.1
  Top 0.61: J3.7 6.35,14.61 6.99,15.24 6.99,20.32 8.26,21.59 v9.53,21.59 U3.33 15.88,21.59 16.51,20.96 16.51,11.43 15.62,10.54 v10.67,10.54 8.45,10.54 | v10.4,47.22 11.8,47.22 12.81,46.22 U7.5
  Top 1.016: J4.6 J4.5
  Bottom 0.61: v9.53,21.59 19.05,21.59 19.68,22.22 19.68,31.75 18.41,33.02 2.54,33.02 1.41,34.16 1.41,45.83 3.41,47.83 9.79,47.83 v10.4,47.22 | J4.6 52.5,13 52.07,12.57 52.07,7.24 12.95,7.24 12.45,7.75 12.45,9.78 11.68,10.54 v10.67,10.54
IO0
  Top 0.61: C9.1 40.96,34.29 12.7,34.29 12.06,33.66 12.06,31.89 U3.25
  Top 0.813: S1.2 40.3,33.62 C9.1
IO1  (via drill 0.35)
  Top 0.61: v18.29,27.05 20.57,27.05 24,30.48 U3.13
  Bottom 0.61: J3.3 14.61,24.77 16.89,27.05 v18.29,27.05
IO2  (via drill 0.35)
  Top 0.61: U3.23 16.27,29.09 v15.49,28.32
  Bottom 0.61: J3.2 14.48,27.31 v15.49,28.32
IO3  (via drill 0.35)
  Top 0.61: U3.24 v14.99,30.24 v14.99,30.23
  Bottom 0.61: J3.1 14.86,29.85 14.99,29.97 v14.99,30.23
N$4
  Top 0.61: J1.S 27.47,67.66 27.48,67.66 28.27,67.66 28.77,67.16 U1.RFH
RN2483_ENABLE  (via drill 0.35)
  Top 0.61: U3.31 8.89,24.13 5.71,27.31 5.71,36.83 8.89,40 v11.43,40 | U2.6 42.09,61.34 41.1,62.33 v40.2,62.33
  Bottom 0.61: v11.43,40 36.92,40 40.2,43.27 v40.2,62.33
RN2483_RESET
  Top 0.61: U3.30 10.16,25.4 6.99,28.57 6.99,36.19 9.53,38.73 15.34,38.73 16.01,39.41 16.9,40.3 16.9,59.33 17.27,59.69 U1.RESET°
RN2483_VDD
  Top 0.61: U1.VDD2 30.27,57.15 33,54.42 36.2,54.42 U1.VDD 36.7,54.91 37.34,54.91 37.35,54.92 C6.1 40.5,54.92 42.09,56.51 U2.1
RXD0  (via drill 0.35)
  Top 0.61: v8.89,20.32 U3.34 13.97,20.32 15.11,19.18 15.11,13.46 v15.24,13.33
  Bottom 0.61: v8.89,20.32 8.26,19.68 J3.5 | J2.2 34.29,24.77 33.66,24.13 33.66,16.51 30.48,13.33 v15.24,13.33
RXD2
  Top 0.61: U3.27 10.16,29.21 9.53,29.85 9.53,34.92 10.16,35.56 25.4,35.56 26.04,36.19 26.04,38.1 27.3,39.37 31.75,39.37 32.38,40 32.38,46.36 33.02,46.99 U1.UART_TX
TXD0  (via drill 0.35)
  Top 0.61: v8.89,19.05 U3.35 13.34,19.05 13.97,18.42 v13.97,15.24
  Bottom 0.61: v8.89,19.05 6.99,17.14 J3.6 | v13.97,15.24 29.21,15.24 31.75,17.78 31.75,26.04 33.02,27.31 J2.3
TXD2
  Top 0.61: U3.28 9.53,27.94 8.26,29.21 8.26,35.56 9.53,36.83 24.13,36.83 24.77,37.47 24.77,38.73 26.67,40.64 30.48,40.64 31.11,41.27 31.11,47.62 31.75,48.26 U1.UART_RX

### Text on the board
tNames: GND | I/O | 3V3 | I/O | TXD0 | I/O | RXD0 | H_EN | E_EN | RXD0 | TXD0 | SDA | SCL | GND | 3V3
tValues: PCB design: niel_v | Battery (10V - 2V) | + | - | INT | SCL | SDA | GND | +3V3
201bmp: C:/Users/nielv/Pictures/sincere_partners_KU-Leuven (2).bmp